# Altium schematic sheet [12]-MCU_INPUTS.SchDoc
size A4
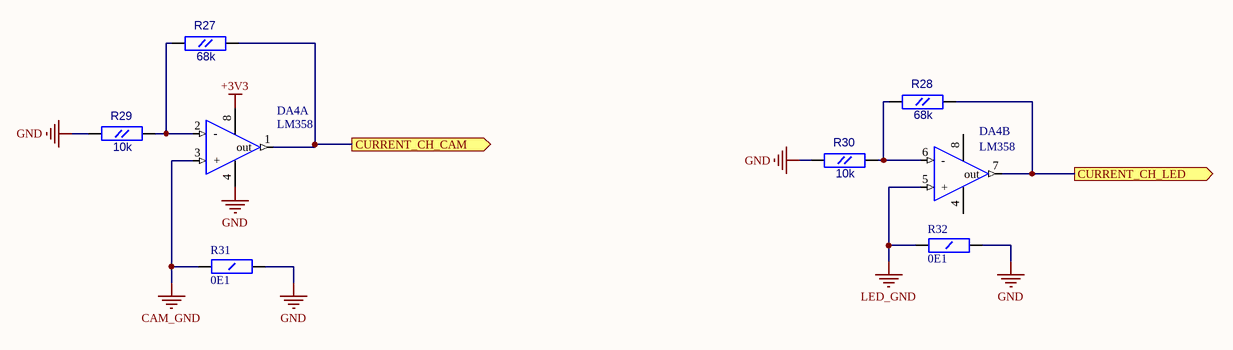
[diagram p0: [12]-MCU_INPUTS.SchDoc]

## Parts
DA4  LM358  [SO-8]  (parts A,B of 2)
R27  68k  [RC0603]
R28  68k  [RC0603]
R29  10k  [RC0603]
R30  10k  [RC0603]
R31  0E1  [R2512]
R32  0E1  [R2512]

## Ports
CURRENT_CH_CAM (out), CURRENT_CH_LED (out)

## Nets
+3V3: DA4.8(V+)
CAM_GND: DA4.3(+) R31.1(A)
GND: DA4.4(V-) R29.1(A) R30.1(A) R31.2(B) R32.2(B)
LED_GND: DA4.5(+) R32.1(A)
CURRENT_CH_CAM: DA4.1(out) R27.2(B) ; port CURRENT_CH_CAM
CURRENT_CH_LED: DA4.7(out) R28.2(B) ; port CURRENT_CH_LED
NetDA4_2: DA4.2(-) R27.1(A) R29.2(B)
NetDA4_6: DA4.6(-) R28.1(A) R30.2(B)

## Library data of the parts
R27-R30 = RC0603
  R27 R28: Value: 68k
  R29 R30: Value: 10k
R31 R32 = RC2512: Resistor 2512 1W; Value: 0E1
DA4 = lm358: Value: LM358